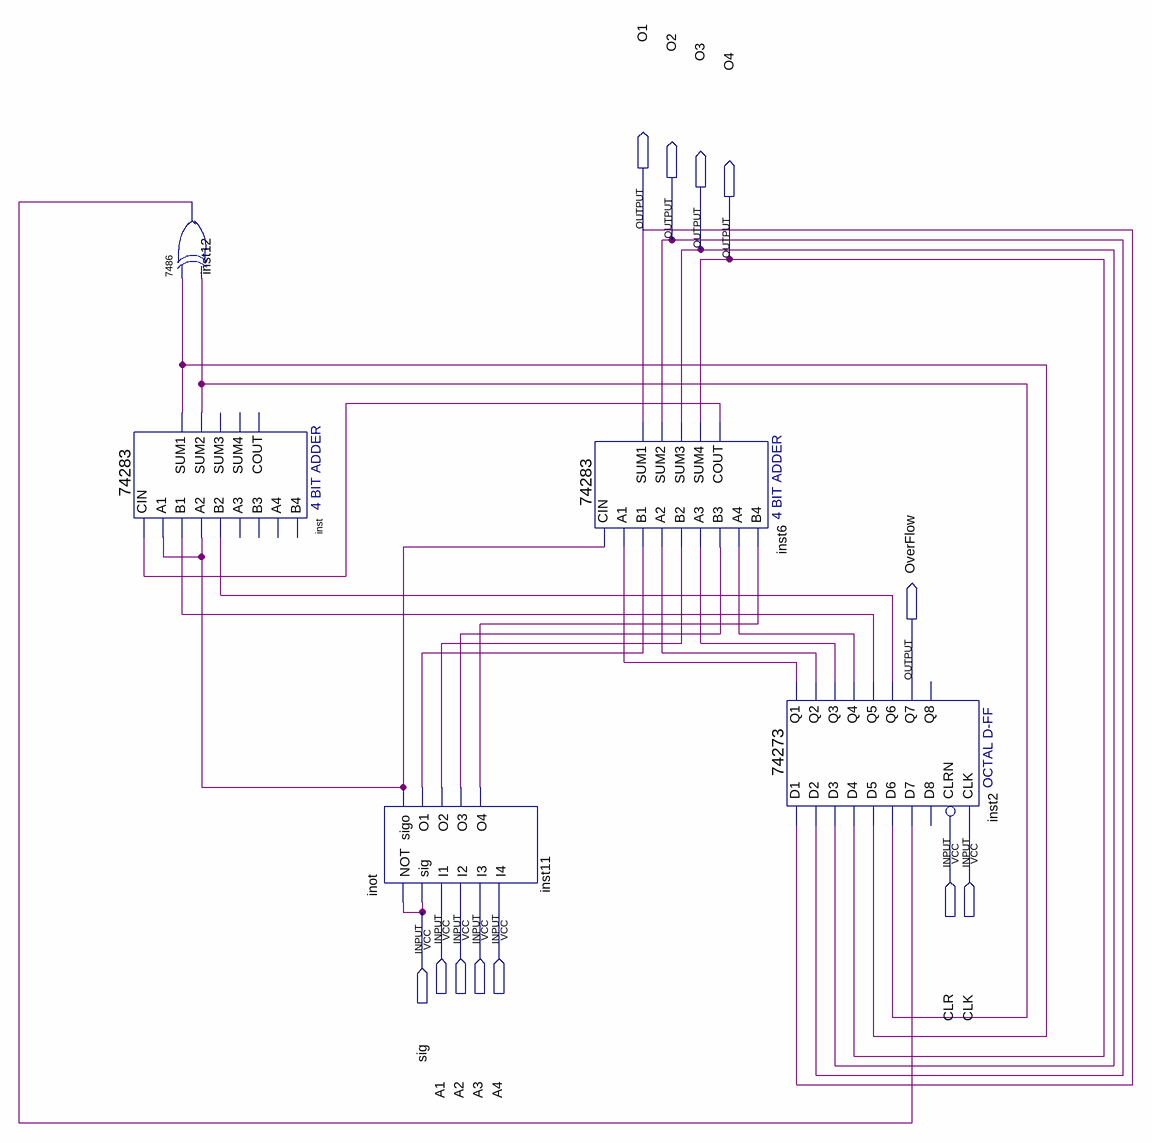
[diagram p0: schematic sheet]
// Quartus schematic COADEXP3.bdf as structural Verilog: 5 symbols, 12 pins
module COADEXP3 (
  input  CLR,
  input  CLK,
  input  A1,
  input  A2,
  input  A3,
  input  A4,
  input  sig,
  output O1,
  output O2,
  output O3,
  output O4,
  output OverFlow
);

  wire inst2_q1, inst2_q2, inst2_q3, inst2_q4, inst2_q5, inst2_q6, inst6_cout, inst11_o1, inst11_o2,
       inst11_o3, inst11_o4, inst11_sigo, inst12_1, inst_sum1, inst_sum2;

  \74283  inst (
    .CIN(inst6_cout), .A1(inst11_sigo), .A2(inst11_sigo), .B2(inst2_q6), .B1(inst2_q5), .SUM1(inst_sum1),
    .SUM2(inst_sum2));  // open: A3, A4, B4, B3, SUM4, COUT, SUM3
  \7486  inst12 (.\2 (inst_sum1), .\3 (inst_sum2), .\1 (inst12_1));
  inot inst11 (
    .NOT(sig), .sig(sig), .I1(A1), .I2(A2), .I3(A3), .I4(A4), .sigo(inst11_sigo), .O1(inst11_o1),
    .O2(inst11_o2), .O3(inst11_o3), .O4(inst11_o4));
  \74283  inst6 (
    .CIN(inst11_sigo), .A1(inst2_q1), .A2(inst2_q2), .B2(inst11_o2), .A3(inst2_q3), .A4(inst2_q4),
    .B4(inst11_o4), .B1(inst11_o1), .B3(inst11_o3), .SUM4(O4), .COUT(inst6_cout), .SUM1(O1), .SUM2(O2),
    .SUM3(O3));
  \74273  inst2 (
    .D2(O2), .D3(O3), .D1(O1), .D4(O4), .D7(inst12_1), .D6(inst_sum2), .D5(inst_sum1), .CLK(CLK), .CLRN(CLR),
    .Q4(inst2_q4), .Q1(inst2_q1), .Q2(inst2_q2), .Q3(inst2_q3), .Q6(inst2_q6), .Q5(inst2_q5), .Q7(OverFlow));  // open: D8, Q8
endmodule
